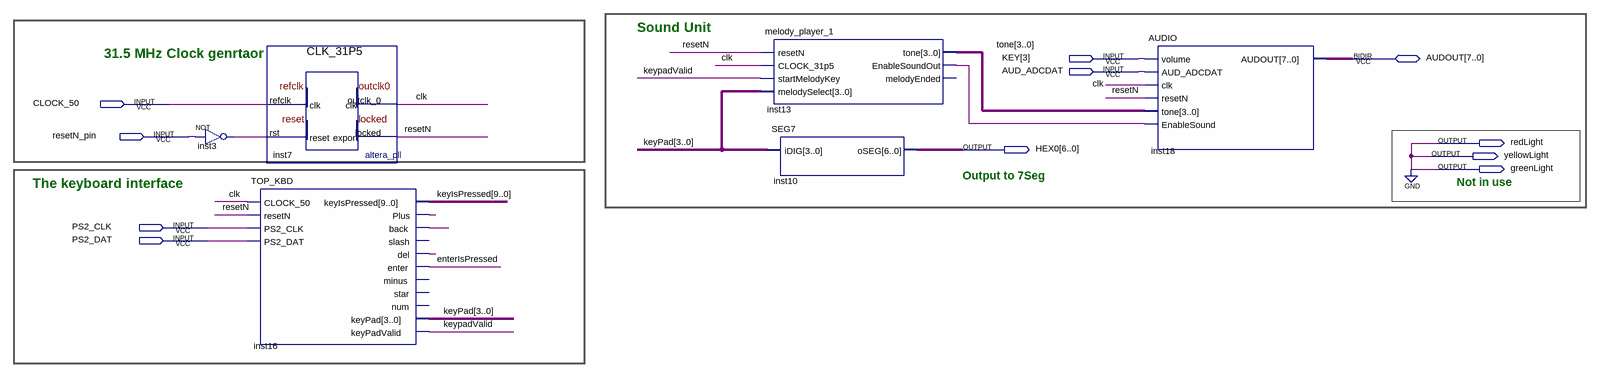
[diagram p0: schematic sheet]
// Quartus schematic TestSound.bdf as structural Verilog: 6 symbols, 11 pins
module TestSound (
  input  [3:3] KEY,
  input  AUD_ADCDAT,
  input  CLOCK_50,
  input  resetN_pin,
  input  PS2_CLK,
  input  PS2_DAT,
  inout  [7:0] AUDOUT,
  output redLight,
  output [6:0] HEX0,
  output yellowLight,
  output greenLight
);

  wire clk, enterIsPressed, inst3_out, inst13_enablesoundout, inst16_back, inst16_del, inst16_plus,
       keypadValid, resetN;
  wire [3:0] keyPad, tone;
  wire [9:0] keyIsPressed;

  not inst3 (inst3_out, resetN_pin);
  CLK_31P5 inst7 (.refclk(CLOCK_50), .rst(inst3_out), .outclk_0(clk), .locked(resetN));
  TOP_KBD inst16 (
    .CLOCK_50(clk), .resetN(resetN), .PS2_CLK(PS2_CLK), .PS2_DAT(PS2_DAT), .keyIsPressed(keyIsPressed),
    .Plus(inst16_plus), .back(inst16_back), .del(inst16_del), .enter(enterIsPressed), .keyPad(keyPad),
    .keyPadValid(keypadValid));  // open: slash, minus, star, num
  melody_player_1 inst13 (
    .resetN(resetN), .CLOCK_31p5(clk), .startMelodyKey(keypadValid), .melodySelect(keyPad), .tone(tone),
    .EnableSoundOut(inst13_enablesoundout));  // open: melodyEnded
  SEG7 inst10 (.iDIG(keyPad), .oSEG(HEX0));
  AUDIO inst18 (
    .volume(KEY[3]), .AUD_ADCDAT(AUD_ADCDAT), .clk(clk), .resetN(resetN), .tone(tone),
    .EnableSound(inst13_enablesoundout), .AUDOUT(AUDOUT));

  assign greenLight = 1'b0;
  assign redLight = 1'b0;
  assign yellowLight = 1'b0;

  // Notes on the sheet:
  //   Sound Unit
  //   31.5 MHz Clock genrtaor
  //   Output to 7Seg
  //   The keyboard interface
  //   Not in use
endmodule
